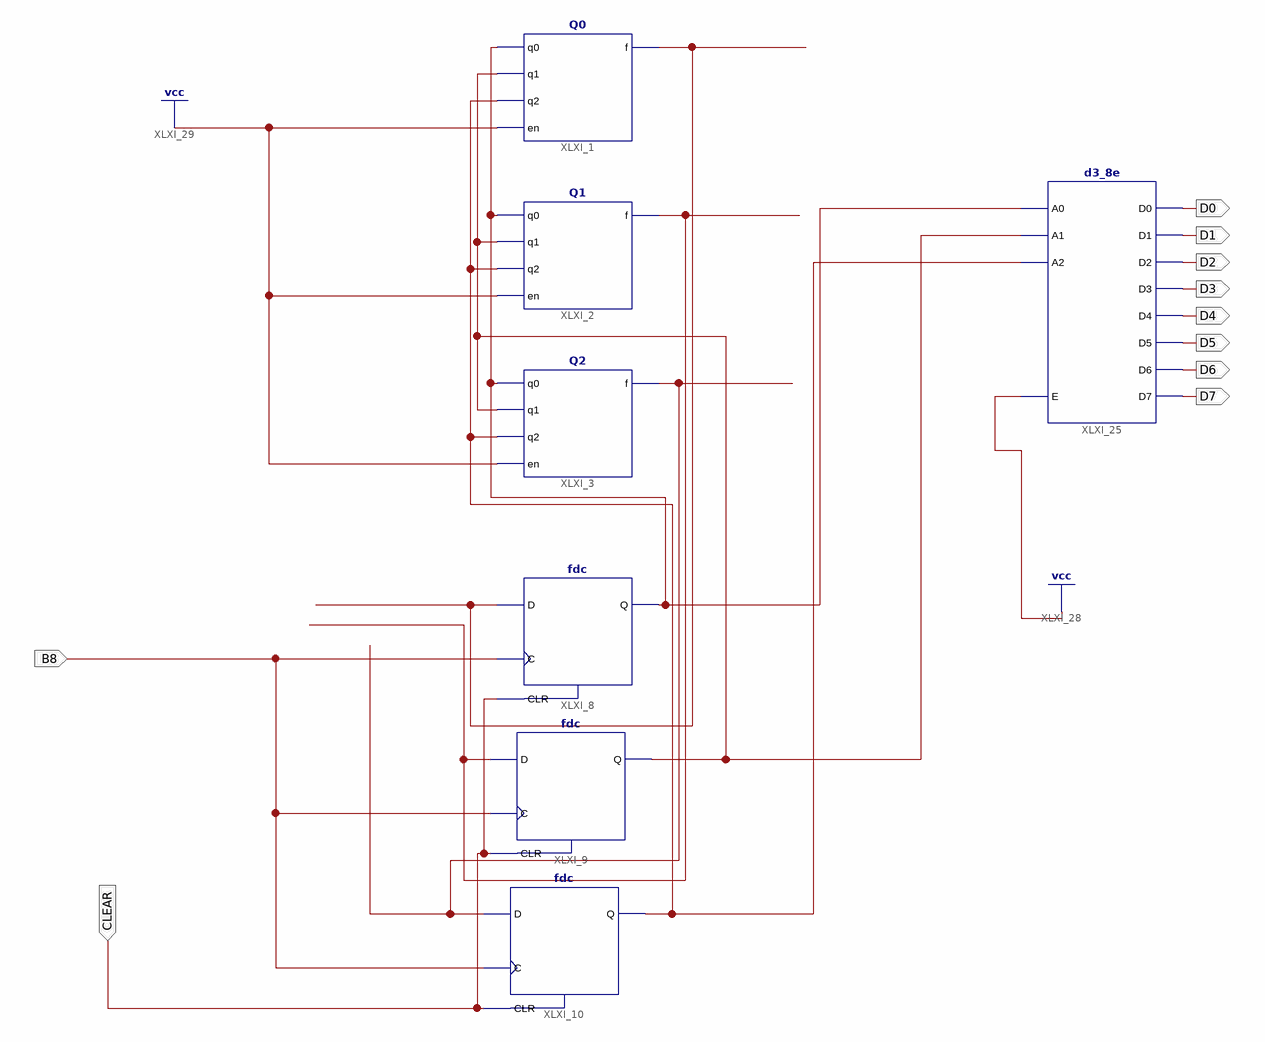
[diagram p0: schematic sheet 1]
// Xilinx ISE schematic schema.sch (spartan3e) as structural Verilog: 7 symbols, 10 ports
module schema (
  input  B8,
  input  CLEAR,
  output D0,
  output D1,
  output D2,
  output D3,
  output D4,
  output D5,
  output D6,
  output D7
);

  wire MEAL0, MEAL1, MEAL2, MOORE0, MOORE1, MOORE2;

  Q0 XLXI_1 (.q0(MEAL0), .q1(MEAL1), .q2(MEAL2), .en(1'b1), .f(MOORE0));
  Q1 XLXI_2 (.q0(MEAL0), .q1(MEAL1), .q2(MEAL2), .en(1'b1), .f(MOORE1));
  Q2 XLXI_3 (.q0(MEAL0), .q1(MEAL1), .q2(MEAL2), .en(1'b1), .f(MOORE2));
  fdc XLXI_8 (.C(B8), .CLR(CLEAR), .D(MOORE0), .Q(MEAL0));
  fdc XLXI_9 (.C(B8), .CLR(CLEAR), .D(MOORE1), .Q(MEAL1));
  fdc XLXI_10 (.C(B8), .CLR(CLEAR), .D(MOORE2), .Q(MEAL2));
  d3_8e XLXI_25 (
    .A0(MEAL0), .A1(MEAL1), .A2(MEAL2), .E(1'b1), .D0(D0), .D1(D1), .D2(D2), .D3(D3), .D4(D4), .D5(D5),
    .D6(D6), .D7(D7));
endmodule
